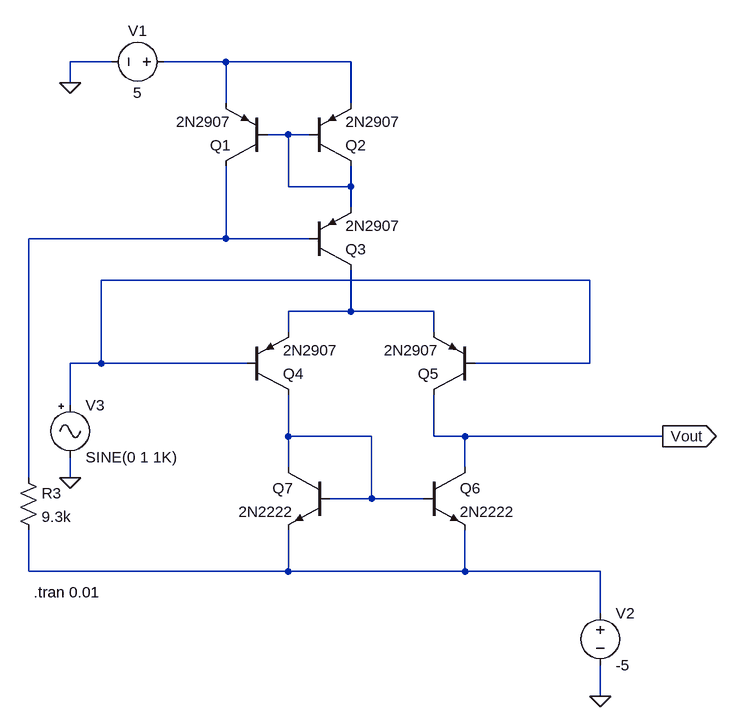
[diagram p0: schematic block1_9.asc]
block1_9.asc, the LTspice schematic file:
Version 4
SHEET 1 1108 1088
WIRE 160 96 96 96
WIRE 336 96 240 96
WIRE 528 96 336 96
WIRE 96 128 96 96
WIRE 336 160 336 96
WIRE 528 160 528 96
WIRE 432 208 400 208
WIRE 464 208 432 208
WIRE 432 288 432 208
WIRE 528 288 528 256
WIRE 528 288 432 288
WIRE 528 320 528 288
WIRE 336 368 336 256
WIRE 336 368 32 368
WIRE 464 368 336 368
WIRE 896 432 144 432
WIRE 528 480 528 416
WIRE 528 480 432 480
WIRE 656 480 528 480
WIRE 432 512 432 480
WIRE 656 512 656 480
WIRE 144 560 144 432
WIRE 144 560 96 560
WIRE 368 560 144 560
WIRE 896 560 720 560
WIRE 896 560 896 432
WIRE 96 624 96 560
WIRE 432 672 432 608
WIRE 560 672 432 672
WIRE 656 672 656 608
WIRE 704 672 656 672
WIRE 1008 672 704 672
WIRE 432 720 432 672
WIRE 704 720 704 672
WIRE 32 736 32 368
WIRE 96 736 96 704
WIRE 560 768 560 672
WIRE 560 768 496 768
WIRE 640 768 560 768
WIRE 32 880 32 816
WIRE 432 880 432 816
WIRE 432 880 32 880
WIRE 704 880 704 816
WIRE 704 880 432 880
WIRE 912 880 704 880
WIRE 912 944 912 880
WIRE 912 1072 912 1024
FLAG 96 128 0
FLAG 912 1072 0
FLAG 1008 672 Vout
IOPIN 1008 672 Out
FLAG 96 736 0
SYMBOL voltage 256 96 R90
WINDOW 0 -32 56 VBottom 2
WINDOW 3 32 56 VTop 2
SYMATTR InstName V1
SYMATTR Value 5
SYMBOL pnp 400 256 R180
SYMATTR InstName Q1
SYMATTR Value 2N2907
SYMBOL pnp 464 256 M180
SYMATTR InstName Q2
SYMATTR Value 2N2907
SYMBOL pnp 464 416 M180
SYMATTR InstName Q3
SYMATTR Value 2N2907
SYMBOL pnp 368 608 M180
SYMATTR InstName Q4
SYMATTR Value 2N2907
SYMBOL pnp 720 608 R180
SYMATTR InstName Q5
SYMATTR Value 2N2907
SYMBOL res 16 720 R0
SYMATTR InstName R3
SYMATTR Value 9.3k
SYMBOL npn 640 720 R0
SYMATTR InstName Q6
SYMATTR Value 2N2222
SYMBOL npn 496 720 M0
SYMATTR InstName Q7
SYMATTR Value 2N2222
SYMBOL voltage 912 928 R0
SYMATTR InstName V2
SYMATTR Value -5
SYMBOL Misc/signal 96 608 R0
SYMATTR InstName V3
TEXT 40 912 Left 2 !.tran 0.01

The netlist it stands for:
* block1_9.asc
V1 N001 0 5
Q1 N003 N002 N001 0 2N2907
Q2 N002 N002 N001 0 2N2907
Q3 N005 N003 N002 0 2N2907
Q4 N006 N004 N005 0 2N2907
Q5 Vout N004 N005 0 2N2907
R3 N003 N007 9.3k
Q6 Vout N006 N007 0 2N2222
Q7 N006 N006 N007 0 2N2222
V2 N007 0 -5
V3 N004 0 SINE(0 1 1K)
.model NPN NPN
.model PNP PNP
.lib standard.bjt
.tran 0.01
.backanno
.end